# EAGLE design PiLoraGatewayV2.6 (EAGLE 6.4)
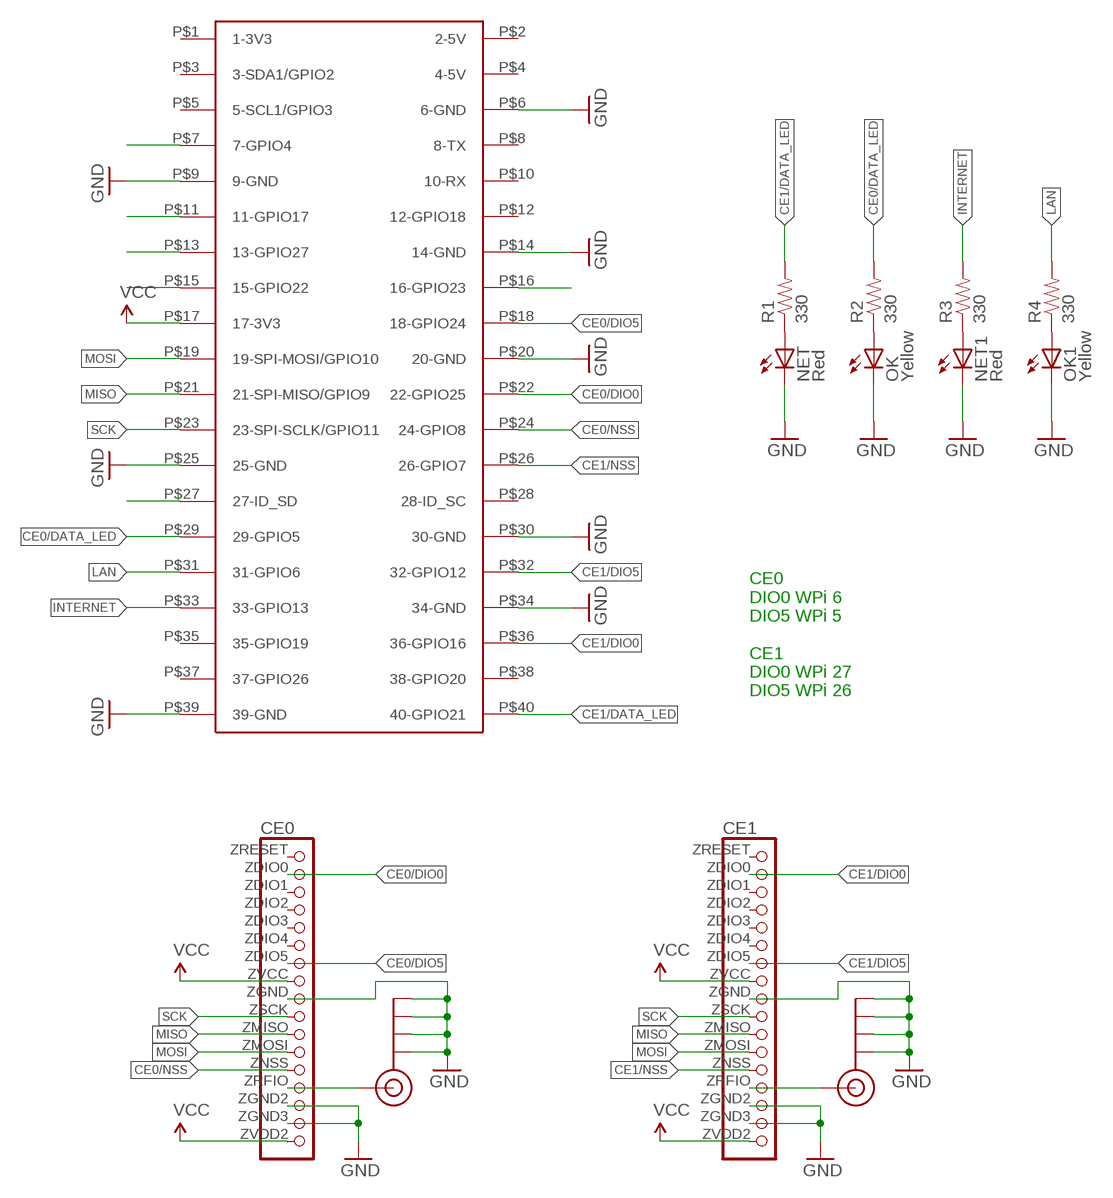
[diagram p0: schematic, sheet 1]

## Parts
CE0  DRF1278F_BKOUTDP1276  [ANYLINK_DP1276]
CE1  DRF1278F_BKOUTDP1276  [ANYLINK_DP1276]
J$1  SMA_EDGE  [SMA-EDGE]
J$2  SMA_EDGE  [SMA-EDGE]
NET  Red  LED0603  [LED-0603]
NET1  Red  LED0603  [LED-0603]
OK  Yellow  LED0603  [LED-0603]
OK1  Yellow  LED0603  [LED-0603]
R1  330  RESISTOR0603-RES  [0603-RES]
R2  330  RESISTOR0603-RES  [0603-RES]
R3  330  RESISTOR0603-RES  [0603-RES]
R4  330  RESISTOR0603-RES  [0603-RES]
U$1  RASPBERRY-PI+  [RASPBERRY-PI-PLUS-CAM_NOTCH]

## Nets
CE0/DATA_LED: R2.2 U$1.P$29(29-GPIO5)
CE0/DIO0: CE0.ZDIO0(DIO0) U$1.P$22(22-GPIO25)
CE0/DIO5: CE0.ZDIO5(DIO5) U$1.P$18(18-GPIO24)
CE0/NSS: CE0.ZNSS(NSS) U$1.P$24(24-GPIO8)
CE1/DATA_LED: R1.2 U$1.P$40(40-GPIO21)
CE1/DIO0: CE1.ZDIO0(DIO0) U$1.P$36(36-GPIO16)
CE1/DIO5: CE1.ZDIO5(DIO5) U$1.P$32(32-GPIO12)
CE1/NSS: CE1.ZNSS(NSS) U$1.P$26(26-GPIO7)
GND: CE0.ZGND2(RGND1) CE0.ZGND3(RGND2) CE0.ZGND(GND) CE1.ZGND2(RGND1) CE1.ZGND3(RGND2) CE1.ZGND(GND) J$1.GND@0(GND) J$1.GND@1(GND) J$1.GND@2(GND) J$1.GND@3(GND) J$2.GND@0(GND) J$2.GND@1(GND) J$2.GND@2(GND) J$2.GND@3(GND) NET1.C NET.C OK1.C OK.C U$1.P$6(6-GND) U$1.P$9(9-GND) U$1.P$14(14-GND) U$1.P$20(20-GND) U$1.P$25(25-GND) U$1.P$30(30-GND) U$1.P$34(34-GND) U$1.P$39(39-GND)
INTERNET: R3.2 U$1.P$33(33-GPIO13)
LAN: R4.2 U$1.P$31(31-GPIO6)
MISO: CE0.ZMISO(MISO) CE1.ZMISO(MISO) U$1.P$21(21-SPI-MISO/GPIO9)
MOSI: CE0.ZMOSI(MOSI) CE1.ZMOSI(MOSI) U$1.P$19(19-SPI-MOSI/GPIO10)
N$1: CE1.ZRFIO(RFIO) J$2.SIG(SIGNAL)
N$2: CE0.ZRFIO(RFIO) J$1.SIG(SIGNAL)
N$3: NET1.A R3.1
N$4: OK1.A R4.1
N$10: U$1.P$16(16-GPIO23)
N$12: OK.A R2.1
N$17: NET.A R1.1
N$28: U$1.P$7(7-GPIO4)
N$33: U$1.P$11(11-GPIO17)
N$34: U$1.P$13(13-GPIO27)
N$35: U$1.P$15(15-GPIO22)
N$41: U$1.P$27(27-ID_SD)
SCK: CE0.ZSCK(SCK) CE1.ZSCK(SCK) U$1.P$23(23-SPI-SCLK/GPIO11)
VCC: CE0.ZVCC(VCC) CE0.ZVDD2(VCC2) CE1.ZVCC(VCC) CE1.ZVDD2(VCC2) U$1.P$17(17-3V3)
Unconnected: CE0.ZDIO1(DIO1) CE0.ZDIO2(DIO2) CE0.ZDIO3(DIO3) CE0.ZDIO4(DIO4) CE0.ZRESET(RESET) CE1.ZDIO1(DIO1) CE1.ZDIO2(DIO2) CE1.ZDIO3(DIO3) CE1.ZDIO4(DIO4) CE1.ZRESET(RESET) U$1.P$1(1-3V3) U$1.P$2(2-5V) U$1.P$3(3-SDA1/GPIO2) U$1.P$4(4-5V) U$1.P$5(5-SCL1/GPIO3) U$1.P$8(8-TX) U$1.P$10(10-RX) U$1.P$12(12-GPIO18) U$1.P$28(28-ID_SC) U$1.P$35(35-GPIO19) U$1.P$37(37-GPIO26) U$1.P$38(38-GPIO20)

## Notes on the sheet
- CE0 
  DIO0 WPi 6 
  DIO5 WPi 5
  
  CE1
  DIO0 WPi 27
  DIO5 WPi 26

## Library data of the parts
CE0 CE1 = adafruit:DRF1278F_BKOUT: PIN HEADER
J$1 J$2 = SparkFun:SMA_EDGE: SMA Antenna Connector End launch SMA connector. The paste layer has been removed so that the connector can be hand soldered onto the board after reflow.
NET NET1 OK OK1 = SparkFun:LED: LEDs Standard schematic elements and footprints for 5mm, 3mm, 1206, and 0603 sized LEDs. 5mm - Spark Fun Electronics SKU : COM-00529 (and others)
R1-R4 = SparkFun:RESISTOR: Resistor Basic schematic elements and footprints for 0603, 1206, and PTH resistors.
U$1 = Ava:RASPBERRY-PI+: Samtec SSW-120-01-T-D

## Net classes
1 vcc: width 0.254 mm

## Board
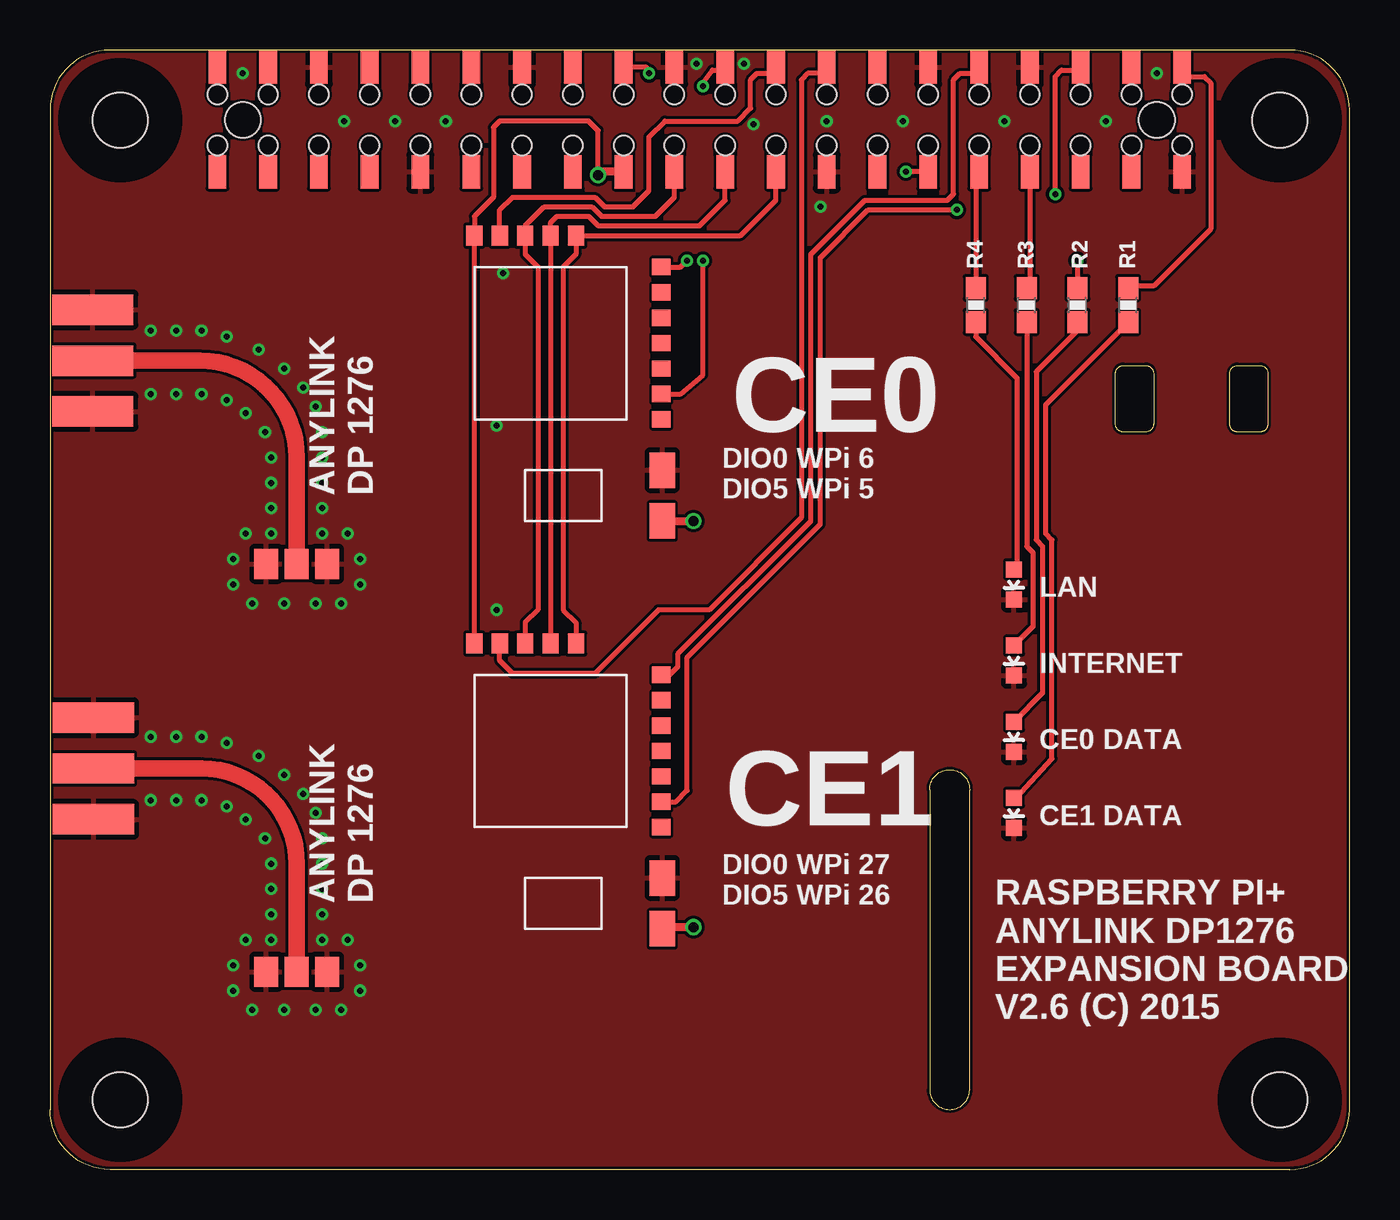
[diagram p1: board, top side]
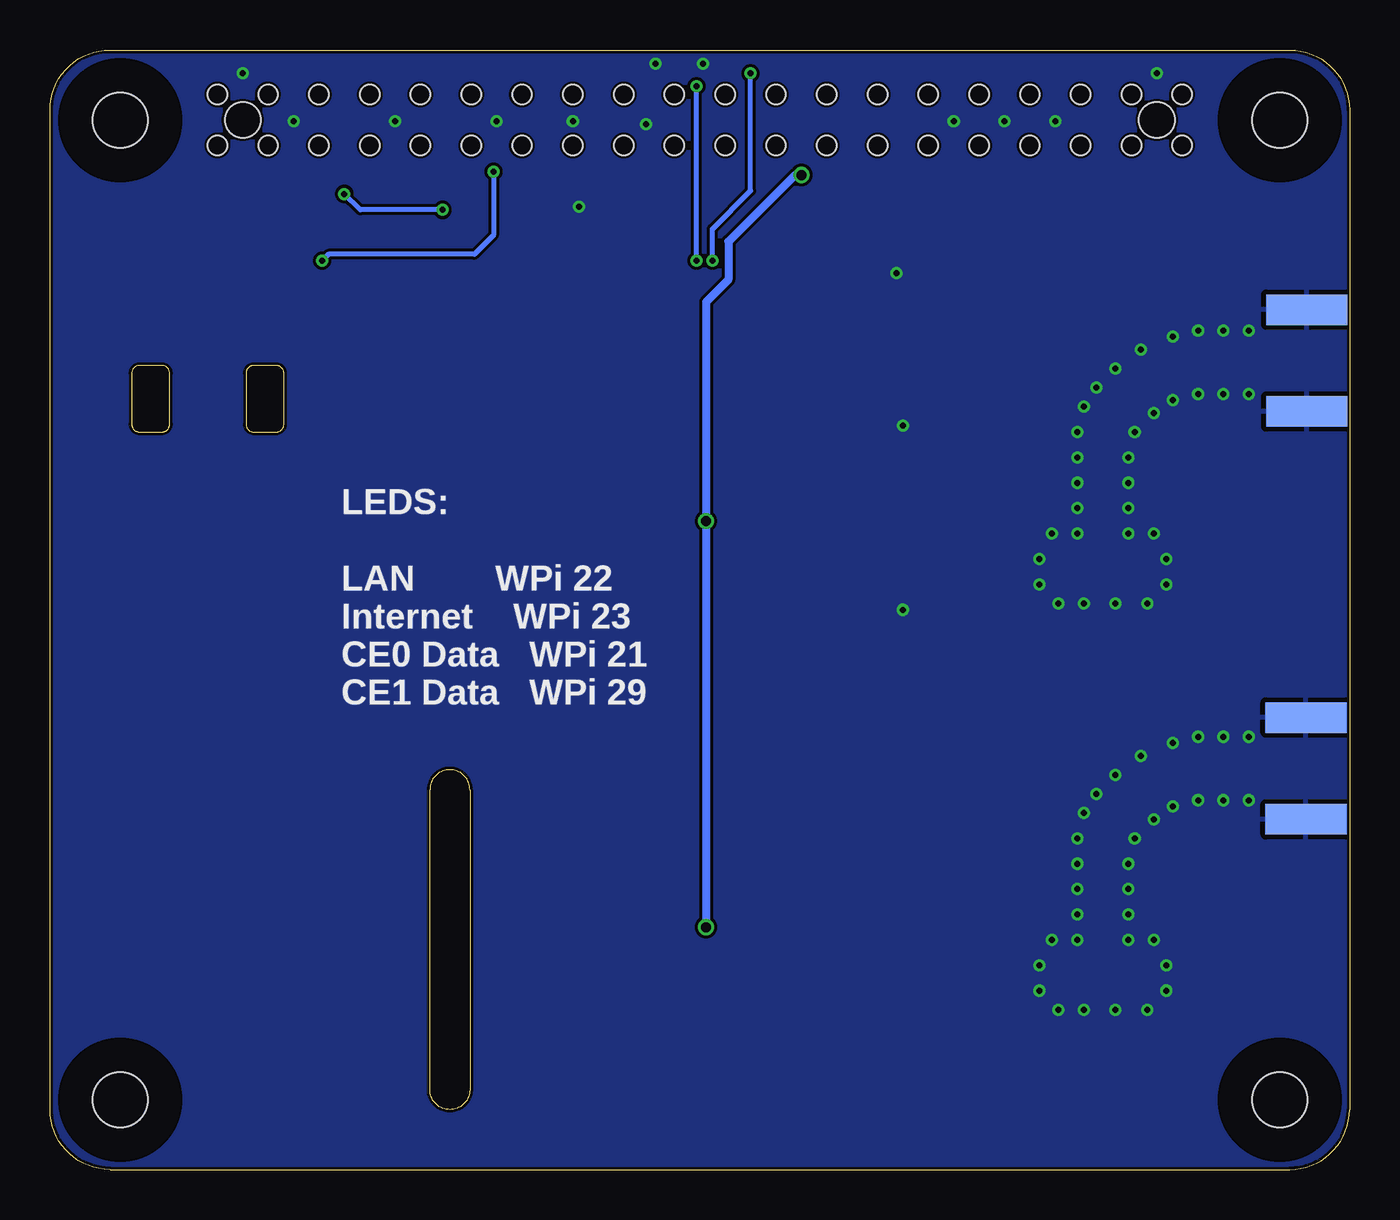
[diagram p2: board, bottom side, seen from below]

Size 65 x 56 mm. Coordinates in mm from the lower left corner, seen from the top.
Outline: 59.41,40.22 60.52,40.22 arc-90 60.91,39.82 60.91,37.29 arc-90 60.52,36.89 59.41,36.89 arc-90 59.01,37.29 59.01,39.82 arc-90 59.41,40.22
Outline: 53.7,40.22 54.8,40.22 arc-90 55.2,39.82 55.2,37.29 arc-90 54.8,36.89 53.7,36.89 arc-90 53.3,37.29 53.3,39.82 arc-90 53.7,40.22
Outline: 62,0 arc90 65,3 65,53 arc90 62,56 3,56 arc90 0,53 0,3 arc90 3,0 62,0
Outline: 44,19 44,4 arc90 45,3 arc90 46,4 46,19 arc90 45,20 arc90 44,19
Copper layers (1*16): Top 0.035mm / dielectric 1.5mm / Bottom 0.035mm
Design rules "hackvana": minimum track width 6mil, minimum drill 0.3mm, track to track 6mil, track to pad 6mil, pad to pad 6mil, via to via 6mil, smd to smd 0mil, copper to edge 6mil, drill to drill 6mil, minimum pad ring 10mil, minimum via ring 6mil, stop-mask expansion 2mil, vias tented up to drill 100mil, thermal gap 10mil

### Footprints (pad centres in the part's own frame; a part is rotated, then mirrored left to right if it is on the bottom)
ANYLINK_DP1276 = smd 0.813 x 0.914: ZDIO0 8.89,-22.047; ZDIO1 10.16,-22.047; ZDIO2 11.43,-22.047; ZDIO3 12.7,-22.047; ZDIO4 13.97,-22.047; ZDIO5 15.24,-22.047; ZRESET 7.62,-22.047 | smd 1.778 x 1.27: ZGND 5.08,-22.098; ZVCC 2.54,-22.098 | smd 1.5 x 1.2: ZGND2 0.389,-2.286; ZGND3 0.389,-5.334; ZRFIO 0.389,-3.81 | smd 1.016 x 0.813: ZMISO 16.81,-16.51; ZMOSI 16.81,-15.24; ZNSS 16.81,-13.97; ZSCK 16.81,-17.78; ZVDD2 16.81,-12.7
SMA-EDGE = smd 1.524 x 4.064: GND@0 -2.54,0; GND@1 2.54,0; SIG 0,0 | smd 1.524 x 4.064 bottom: GND@2 -2.54,0; GND@3 2.54,0
LED-0603 = smd 0.8 x 0.8: A 0,-0.75; C 0,0.75
0603-RES = smd 1.1 x 1: 1 -0.85,0; 2 0.85,0
RASPBERRY-PI-PLUS-CAM_NOTCH = smd 0.889 x 1.68: P$1 -34.13,21.905; P$2 -34.13,27.145; P$3 -31.59,21.905; P$4 -31.59,27.145; P$5 -29.05,21.905; P$6 -29.05,27.145; P$7 -26.51,21.905; P$8 -26.51,27.145; P$9 -23.97,21.905; P$10 -23.97,27.145; P$11 -21.43,21.905; P$12 -21.43,27.145; P$13 -18.89,21.905; P$14 -18.89,27.145; P$15 -16.35,21.905; P$16 -16.35,27.145; P$17 -13.81,21.905; P$18 -13.81,27.145; P$19 -11.27,21.905; P$20 -11.27,27.145; P$21 -8.73,21.905; P$22 -8.73,27.145; P$23 -6.19,21.905; P$24 -6.19,27.145; P$25 -3.65,21.905; P$26 -3.65,27.145; P$27 -1.11,21.905; P$28 -1.11,27.145; P$29 1.43,21.905; P$30 1.43,27.145; P$31 3.97,21.905; P$32 3.97,27.145; P$33 6.51,21.905; P$34 6.51,27.145; P$35 9.05,21.905; P$36 9.05,27.145; P$37 11.59,21.905; P$38 11.59,27.145; P$39 14.13,21.905; P$40 14.13,27.145 | hole 2.75: -39,24.5; 19,24.5; -39,-24.5; 19,-24.5 | hole 1.78: -32.86,24.5; 12.86,24.5 | hole 0.97: -34.13,25.77; -31.59,25.77; -29.05,25.77; -26.51,25.77; -23.97,25.77; -21.43,25.77; -18.89,25.77; -16.35,25.77; -13.81,25.77; -11.27,25.77; -8.73,25.77; -6.19,25.77; -3.65,25.77; -1.11,25.77; 1.43,25.77; 3.97,25.77; 6.51,25.77; 9.05,25.77; 11.59,25.77; 14.13,25.77; -34.13,23.23; -31.59,23.23; -29.05,23.23; -26.51,23.23; -23.97,23.23; -21.43,23.23; -18.89,23.23; -16.35,23.23; -13.81,23.23; -11.27,23.23; -8.73,23.23; -6.19,23.23; -3.65,23.23; -1.11,23.23; 1.43,23.23; 3.97,23.23; 6.51,23.23; 9.05,23.23; 11.59,23.23; 14.13,23.23

### Placement (x,y rotation side)
CE0  8.53,29.91 90 top
CE1  8.53,9.51 90 top
J$1  2.14,40.46 270 top
J$2  2.18,20.06 90 top
NET  48.22,17.84 180 top
NET1  48.22,25.46 180 top
OK  48.22,21.65 180 top
OK1  48.22,29.27 180 top
R1  53.93,43.24 90 top
R2  51.39,43.24 90 top
R3  48.85,43.24 90 top
R4  46.31,43.24 90 top
U$1  42.5,28 0 top

### Tracks (layer width: path | path; a pad name or v marks a point on that pad's centre or on a via)
CE0/DATA_LED  (via drill 0.3)
  Top 0.254: 51.55,44.25 R2.2 v51.39,45.46 | U$1.P$29 v42.82,49.91
  Bottom 0.254: v42.82,49.91 42.82,46.73 43.77,45.78 51.07,45.78 v51.39,45.46
CE0/DIO0  (via drill 0.3)
  Top 0.254: CE0.ZDIO0 31.55,38.8 32.66,39.75 v32.66,45.46 | v32.66,54.19 32.66,54.35 33.13,54.99 33.61,54.99 U$1.P$22
  Bottom 0.254: v32.66,45.46 v32.66,54.19
CE0/DIO5  (via drill 0.3)
  Top 0.254: CE0.ZDIO5 31.55,45.14 v31.86,45.46 | U$1.P$18 29.8,55.15 29.96,54.99 v29.96,54.83
  Bottom 0.254: v31.86,45.46 31.86,47.05 29.96,48.95 v29.96,54.83
CE0/NSS
  Top 0.254: CE0.ZNSS 22.5,48 23.13,48.64 27.26,48.64 27.74,48.16 29.16,48.16 29.96,48.95 29.96,51.65 30.75,52.45 34.4,52.45 35.04,53.08 35.04,54.51 35.36,54.83 35.99,54.83 U$1.P$24
CE1/DATA_LED
  Top 0.254: 54.09,44.25 R1.2 54.03,44.19 55.2,44.19 58.06,47.05 58.06,54.35 57.74,54.67 56.79,54.67 56.63,54.83 U$1.P$40
CE1/DIO0  (via drill 0.3)
  Top 0.254: CE1.ZDIO0 31.31,18.4 31.86,18.95 31.86,25.62 38.53,32.29 38.53,45.62 40.91,48 v45.36,48 | v50.28,48.8 50.28,54.67 50.6,54.99 51.39,54.99 U$1.P$36
  Bottom 0.254: v45.36,48 49.48,48 v50.28,48.8
CE1/DIO5
  Top 0.254: U$1.P$32 46.15,54.83 45.52,54.83 45.2,54.51 45.2,48.8 44.88,48.48 40.75,48.48 38.05,45.78 38.05,32.45 31.39,25.78 31.39,25.14 30.91,24.67 30.59,24.77 CE1.ZDIO5
CE1/NSS
  Top 0.254: U$1.P$26 38.85,54.99 38.69,54.83 37.9,54.83 37.58,54.51 37.58,32.6 32.98,28 30.44,28 27.26,24.82 23.13,24.82 22.5,25.46 CE1.ZNSS
GND  (via drill 0.3)
  other vias: 47.74,52.45 42.66,52.45 19.8,52.45 17.26,52.45 14.72,52.45 52.82,52.45 35.2,52.29 38.53,48.16 38.85,52.45 32.34,55.3 34.72,55.3 55.36,54.83 9.64,54.83 5.03,41.97 5.03,38.8 6.3,41.97 7.58,41.97 6.3,38.8 7.58,38.8 8.84,38.48 9.8,37.84 10.75,36.89 11.07,35.62 11.07,34.35 11.07,33.08 11.07,31.81 8.84,41.65 10.43,41.02 11.7,40.06 12.66,39.11 13.29,38.16 13.61,36.89 13.61,35.62 13.61,34.35 13.61,33.08 13.61,31.81 9.8,31.81 14.88,31.81 15.51,30.54 9.16,30.54 9.16,29.27 15.51,29.27 14.56,28.32 13.29,28.32 10.12,28.32 11.7,28.32 5.03,21.65 5.03,18.48 6.3,21.65 7.58,21.65 6.3,18.48 7.58,18.48 8.84,18.16 9.8,17.52 10.75,16.57 11.07,15.3 11.07,14.03 11.07,12.76 11.07,11.49 8.84,21.33 10.43,20.7 11.7,19.74 12.66,18.79 13.29,17.84 13.61,16.57 13.61,15.3 13.61,14.03 13.61,12.76 13.61,11.49 9.8,11.49 14.88,11.49 15.51,10.22 9.16,10.22 9.16,8.95 15.51,8.95 14.56,8 13.29,8 10.12,8 11.7,8 22.66,44.83 22.34,28 22.34,37.21
  pour Top: 0,56 65,56 65,0 0,0
  pour Bottom: 0,56 65,56 65,0 0,0
INTERNET
  Top 0.254: U$1.P$33 49.01,44.25 R3.2
LAN
  Top 0.254: 46.47,44.25 R4.2 46.31,49.91 U$1.P$31
MISO
  Top 0.254: CE1.ZMISO CE0.ZMISO 25.04,47.37 25.36,47.69 26.94,47.69 27.42,47.21 32.5,47.21 33.77,48.48 U$1.P$21
MOSI
  Top 0.254: CE1.ZMOSI 23.77,27.36 24.4,28 24.4,45.14 23.77,45.78 CE0.ZMOSI 23.77,47.21 24.72,48.16 27.1,48.16 27.58,47.69 30.28,47.69 31.23,48.64 U$1.P$19
N$1
  Top 0.813: J$2.SIG 7.58,20.06 arc-90 12.34,15.3 CE1.ZRFIO
N$2
  Top 0.813: J$1.SIG 7.5,40.46 arc-90 12.34,35.62 CE0.ZRFIO
N$3
  Top 0.254: R3.1 48.85,31.18 49.17,30.86 49.17,27.16 NET1.A
N$4
  Top 0.254: R4.1 46.31,41.65 48.37,39.59 48.37,30.18 OK1.A
N$12
  Top 0.254: R2.1 51.39,41.97 49.33,39.91 49.33,31.49 49.64,31.18 49.64,23.83 OK.A
N$17
  Top 0.254: NET.A 48.33,18.59 50.12,20.54 50.12,31.49 49.8,31.81 49.8,38.26 R1.1
SCK
  Top 0.254: CE1.ZSCK 26.31,27.36 25.67,28 25.67,45.14 26.31,45.78 CE0.ZSCK 34.55,46.72 36.31,48.48 U$1.P$23
VCC  (via drill 0.5)
  Top 0.254: v27.42,49.75 27.42,51.97 26.94,52.45 22.5,52.45 22.18,52.13 22.18,48.64 21.23,47.69 CE0.ZVDD2 CE1.ZVDD2
  Top 0.406: U$1.P$17 27.57,49.91 v27.42,49.75 | v32.18,12.12 30.7,12.12 CE1.ZVCC | CE0.ZVCC v32.18,32.45
  Bottom 0.406: v27.42,49.75 27.74,49.75 31.07,46.41 31.07,44.51 32.18,43.4 32.18,32.6 v32.18,32.45 v32.18,12.12

### Text on the board
tPlace: CE0 | DIO0 WPi 6 / DIO5 WPi 5 | LAN | INTERNET | CE0 DATA | CE1 | CE1 DATA | DIO0 WPi 27 / DIO5 WPi 26 | RASPBERRY PI+ / ANYLINK DP1276 / EXPANSION BOARD / V2.6 (C) 2015
bPlace: LEDS: / / LAN WPi 22 / Internet WPi 23 / CE0 Data WPi 21 / CE1 Data WPi 29
_tNames: R4 | R3 | R2 | R1